# Altium schematic sheet PowerBoard.SchDoc: Power Board Top
size A4; CompanyName: Spectre; DrawnBy: Jarod Krane; Organization: Altium Limited; Address1: L3, 12a Rodborough Rd; Address2: Frenchs Forest; Address3: NSW; Address4: Australia 2086; Revision: 0; SheetNumber: 1; SheetTotal: 11
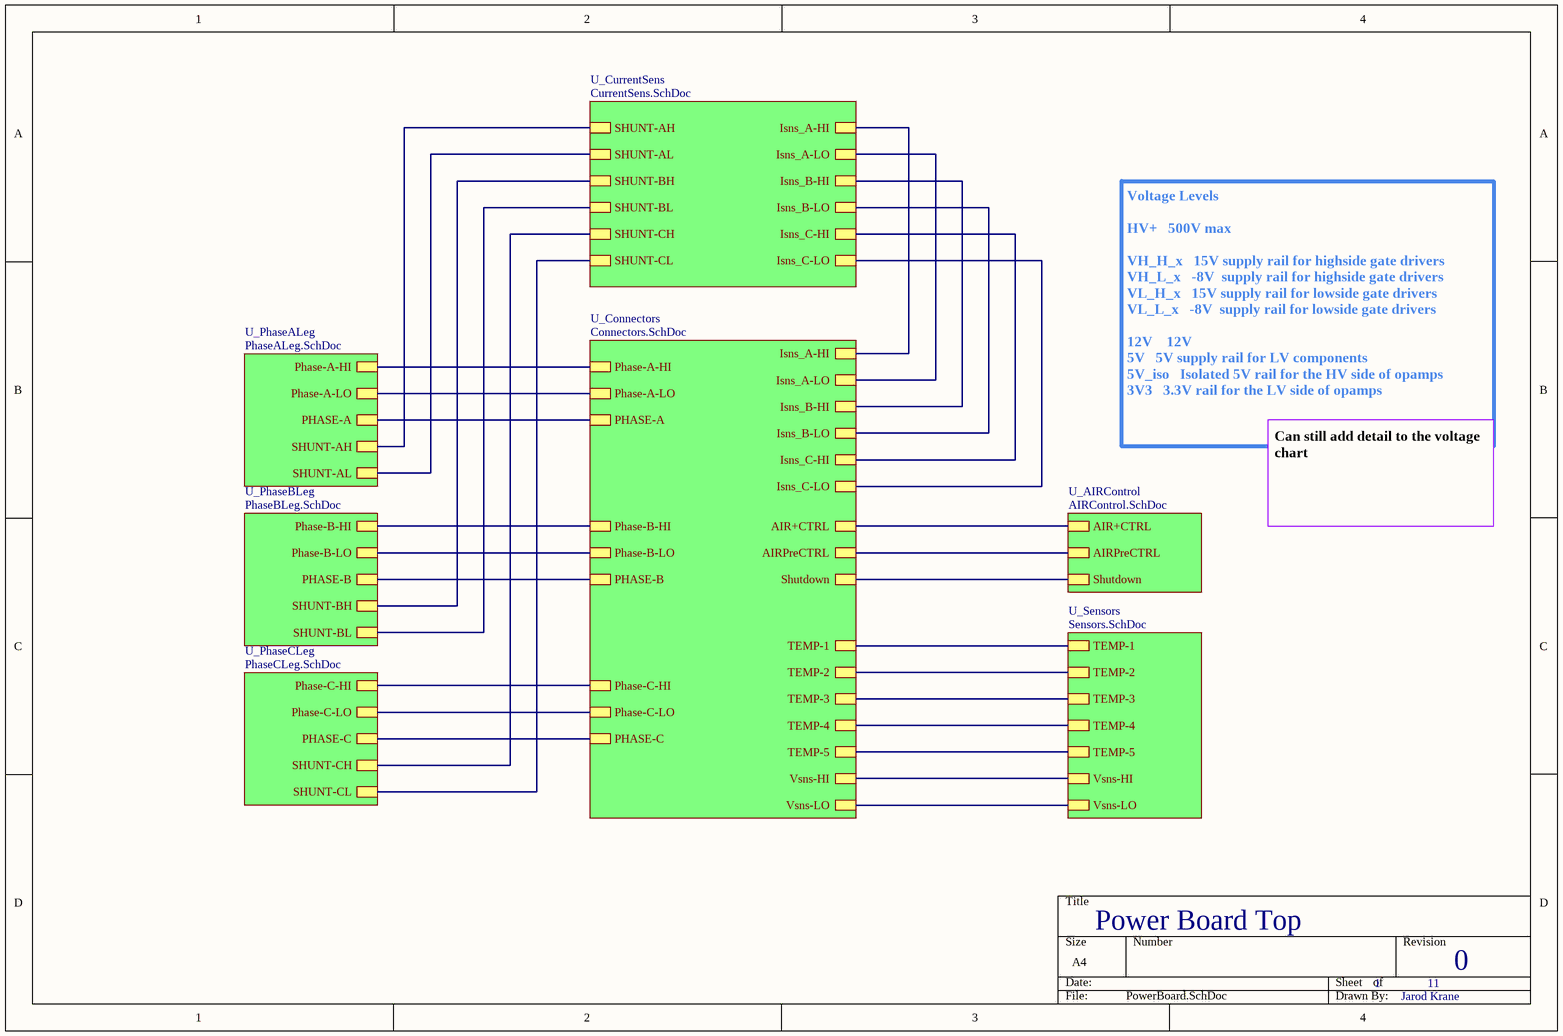
[diagram p0: PowerBoard.SchDoc]

## Sub-sheets
U_AIRControl = AIRControl.SchDoc: Shutdown, AIRPreCTRL, AIR+CTRL
U_Connectors = Connectors.SchDoc: Phase-C-HI, Phase-C-LO, Phase-A-HI, Phase-A-LO, Phase-B-HI, Phase-B-LO, Isns_A-HI, Isns_A-LO, Isns_B-HI, Isns_B-LO, Isns_C-HI, Isns_C-LO, PHASE-A, PHASE-B, PHASE-C, TEMP-1, TEMP-2, TEMP-3, TEMP-4, TEMP-5, Vsns-HI, Vsns-LO, Shutdown, AIRPreCTRL, AIR+CTRL
U_CurrentSens = CurrentSens.SchDoc: Isns_A-HI, Isns_A-LO, Isns_B-HI, Isns_B-LO, Isns_C-HI, Isns_C-LO, SHUNT-AH, SHUNT-AL, SHUNT-BH, SHUNT-BL, SHUNT-CH, SHUNT-CL
U_PhaseALeg = PhaseALeg.SchDoc: Phase-A-HI, Phase-A-LO, PHASE-A, SHUNT-AH, SHUNT-AL
U_PhaseBLeg = PhaseBLeg.SchDoc: Phase-B-HI, Phase-B-LO, PHASE-B, SHUNT-BH, SHUNT-BL
U_PhaseCLeg = PhaseCLeg.SchDoc: Phase-C-HI, Phase-C-LO, PHASE-C, SHUNT-CH, SHUNT-CL
U_Sensors = Sensors.SchDoc: TEMP-1, TEMP-2, TEMP-3, TEMP-4, TEMP-5, Vsns-HI, Vsns-LO

## Nets
(unnamed): sheet U_PhaseALeg/Phase-A-HI, sheet U_Connectors/Phase-A-HI
(unnamed): sheet U_PhaseALeg/Phase-A-LO, sheet U_Connectors/Phase-A-LO
(unnamed): sheet U_PhaseALeg/PHASE-A, sheet U_Connectors/PHASE-A
(unnamed): sheet U_PhaseALeg/SHUNT-AH, sheet U_CurrentSens/SHUNT-AH
(unnamed): sheet U_PhaseALeg/SHUNT-AL, sheet U_CurrentSens/SHUNT-AL
(unnamed): sheet U_PhaseBLeg/Phase-B-HI, sheet U_Connectors/Phase-B-HI
(unnamed): sheet U_PhaseBLeg/Phase-B-LO, sheet U_Connectors/Phase-B-LO
(unnamed): sheet U_PhaseBLeg/PHASE-B, sheet U_Connectors/PHASE-B
(unnamed): sheet U_PhaseBLeg/SHUNT-BH, sheet U_CurrentSens/SHUNT-BH
(unnamed): sheet U_PhaseBLeg/SHUNT-BL, sheet U_CurrentSens/SHUNT-BL
(unnamed): sheet U_PhaseCLeg/Phase-C-HI, sheet U_Connectors/Phase-C-HI
(unnamed): sheet U_PhaseCLeg/Phase-C-LO, sheet U_Connectors/Phase-C-LO
(unnamed): sheet U_PhaseCLeg/PHASE-C, sheet U_Connectors/PHASE-C
(unnamed): sheet U_PhaseCLeg/SHUNT-CH, sheet U_CurrentSens/SHUNT-CH
(unnamed): sheet U_PhaseCLeg/SHUNT-CL, sheet U_CurrentSens/SHUNT-CL
(unnamed): sheet U_Sensors/TEMP-1, sheet U_Connectors/TEMP-1
(unnamed): sheet U_Sensors/TEMP-2, sheet U_Connectors/TEMP-2
(unnamed): sheet U_Sensors/TEMP-3, sheet U_Connectors/TEMP-3
(unnamed): sheet U_Sensors/TEMP-4, sheet U_Connectors/TEMP-4
(unnamed): sheet U_Sensors/TEMP-5, sheet U_Connectors/TEMP-5
(unnamed): sheet U_Sensors/Vsns-HI, sheet U_Connectors/Vsns-HI
(unnamed): sheet U_Sensors/Vsns-LO, sheet U_Connectors/Vsns-LO
(unnamed): sheet U_AIRControl/Shutdown, sheet U_Connectors/Shutdown
(unnamed): sheet U_AIRControl/AIRPreCTRL, sheet U_Connectors/AIRPreCTRL
(unnamed): sheet U_AIRControl/AIR+CTRL, sheet U_Connectors/AIR+CTRL
(unnamed): sheet U_Connectors/Isns_A-HI, sheet U_CurrentSens/Isns_A-HI
(unnamed): sheet U_Connectors/Isns_A-LO, sheet U_CurrentSens/Isns_A-LO
(unnamed): sheet U_Connectors/Isns_B-HI, sheet U_CurrentSens/Isns_B-HI
(unnamed): sheet U_Connectors/Isns_B-LO, sheet U_CurrentSens/Isns_B-LO
(unnamed): sheet U_Connectors/Isns_C-HI, sheet U_CurrentSens/Isns_C-HI
(unnamed): sheet U_Connectors/Isns_C-LO, sheet U_CurrentSens/Isns_C-LO

## Notes on the sheet
- Voltage Levels
  HV+	  500V max
  VH_H_x	  15V supply rail for highside gate drivers
  VH_L_x	  -8V  supply rail for highside gate drivers
  VL_H_x	  15V supply rail for lowside gate drivers
  VL_L_x	  -8V  supply rail for lowside gate drivers
  12V 	  12V
  5V	  5V supply rail for LV components
  5V_iso	  Isolated 5V rail for the HV side of opamps
  3V3	  3.3V rail for the LV side of opamps
- Can still add detail to the voltage chart
- Title
- Size:
- Date:
- A4
- Number:
- Time:
- Revision:
- Sheet
- of
- File: